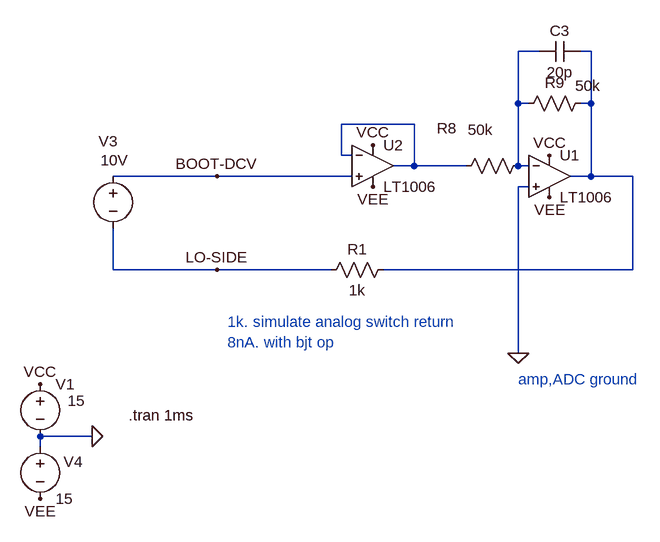
[diagram p0: schematic Draft09.asc]
Draft09.asc, the LTspice schematic file:
Version 4
SHEET 1 2756 2104
WIRE -96 -736 -128 -736
WIRE -16 -736 -32 -736
WIRE -128 -656 -128 -736
WIRE -112 -656 -128 -656
WIRE -16 -656 -16 -736
WIRE -16 -656 -32 -656
WIRE -288 -624 -400 -624
WIRE -400 -576 -400 -624
WIRE -384 -576 -400 -576
WIRE -288 -560 -288 -624
WIRE -288 -560 -320 -560
WIRE -208 -560 -288 -560
WIRE -128 -560 -128 -656
WIRE -112 -560 -128 -560
WIRE -592 -544 -752 -544
WIRE -384 -544 -592 -544
WIRE -16 -544 -16 -656
WIRE -16 -544 -48 -544
WIRE 48 -544 -16 -544
WIRE -112 -528 -128 -528
WIRE -752 -400 -752 -464
WIRE -592 -400 -752 -400
WIRE -416 -400 -592 -400
WIRE 48 -400 48 -544
WIRE 48 -400 -336 -400
WIRE -128 -272 -128 -528
WIRE -784 -144 -864 -144
WIRE -864 -128 -864 -144
FLAG -864 -224 VCC
FLAG -864 -48 VEE
FLAG -784 -144 0
FLAG -80 -576 VCC
FLAG -80 -512 VEE
FLAG -128 -272 0
FLAG -592 -400 LO-SIDE
FLAG -592 -544 BOOT-DCV
FLAG -352 -592 VCC
FLAG -352 -528 VEE
SYMBOL voltage -864 -240 R0
WINDOW 123 0 0 Left 0
WINDOW 39 0 0 Left 0
WINDOW 3 42 41 Left 2
SYMATTR Value 15
SYMATTR InstName V1
SYMBOL voltage -864 -144 R0
WINDOW 123 0 0 Left 0
WINDOW 39 0 0 Left 0
WINDOW 0 36 39 Left 2
SYMATTR InstName V4
SYMATTR Value 15
SYMBOL OpAmps\\LT1006 -80 -608 R0
SYMATTR InstName U1
SYMBOL voltage -752 -560 R0
WINDOW 123 0 0 Left 0
WINDOW 39 0 0 Left 0
WINDOW 3 -19 -9 Left 2
WINDOW 0 -22 -38 Left 2
SYMATTR Value 10V
SYMATTR InstName V3
SYMBOL res -224 -544 R270
WINDOW 0 58 -14 VTop 2
WINDOW 3 87 38 VBottom 2
SYMATTR InstName R8
SYMATTR Value 50k
SYMBOL res -128 -640 R270
WINDOW 0 32 56 VTop 2
WINDOW 3 59 107 VBottom 2
SYMATTR InstName R9
SYMATTR Value 50k
SYMBOL OpAmps\\LT1006 -352 -624 R0
SYMATTR InstName U2
SYMBOL cap -32 -752 R90
WINDOW 0 0 32 VBottom 2
WINDOW 3 32 32 VTop 2
SYMATTR InstName C3
SYMATTR Value 20p
SYMBOL res -320 -416 R90
WINDOW 0 0 56 VBottom 2
WINDOW 3 32 56 VTop 2
SYMATTR InstName R1
SYMATTR Value 1k
TEXT -728 -176 Left 2 !.tran 1ms
TEXT -128 -232 Left 2 ;amp,ADC ground
TEXT -576 -320 Left 2 ;1k. simulate analog switch return\n8nA. with bjt op

The netlist it stands for:
* Draft09.asc
V1 VCC 0 15
V4 0 VEE 15
XU1 0 N001 VCC VEE N002 LT1006  ; pins In+ In- V+ V- OUT
V3 BOOT-DCV LO-SIDE 10V
R8 N003 N001 50k
R9 N001 N002 50k
XU2 BOOT-DCV N003 VCC VEE N003 LT1006  ; pins In+ In- V+ V- OUT
C3 N002 N001 20p
R1 N002 LO-SIDE 1k
.tran 1ms
* amp,ADC ground
* 1k. simulate analog switch return
* 8nA. with bjt op
.lib LTC.lib
.backanno
.end